# Altium schematic sheet power.SchDoc
size A2
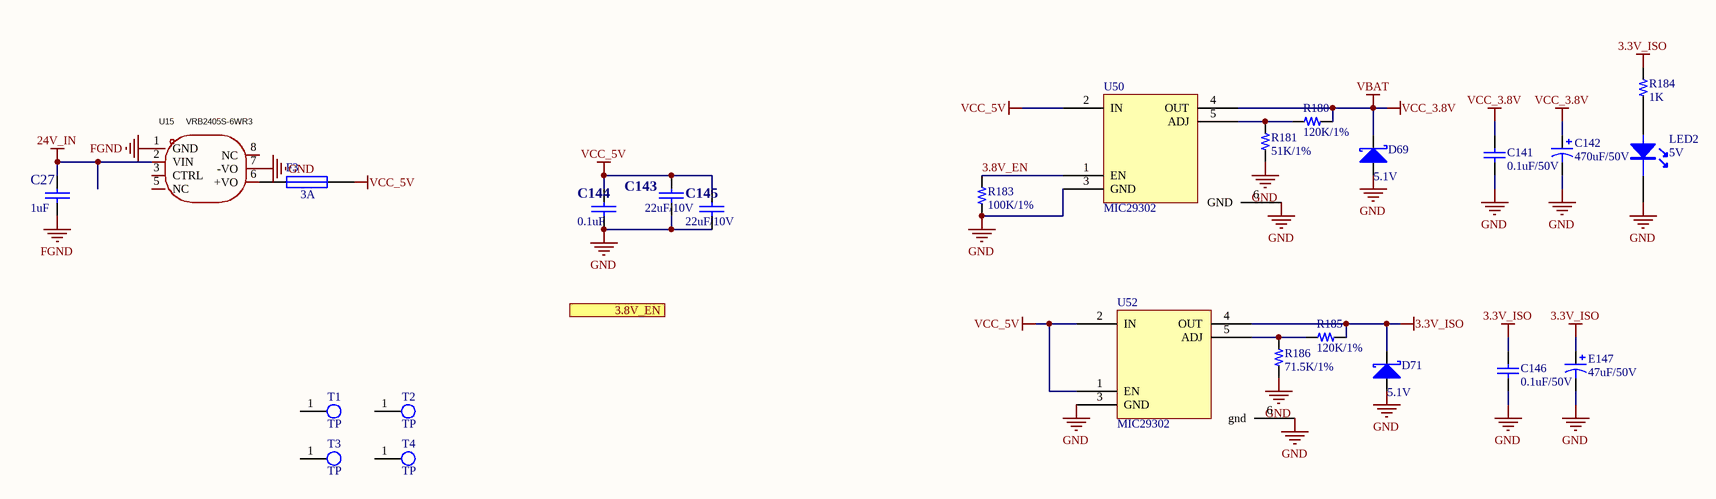
[diagram p0: power.SchDoc]

## Parts
C27  1uF  [0603C]
C141  0.1uF/50V  [0603C]
C142  470uF/50V  [Φ10×10]
C143  22uF/10V  [1210C]
C144  0.1uF  [0603C]
C145  22uF/10V  [1210C]
C146  0.1uF/50V  [0603C]
D69  5.1V  [SMA]
D71  5.1V  [SMA]
E147  47uF/50V  [Φ10×10]
F3  3A  [1812-F]
LED2  5V  [0603LED]
R180  120K/1%  [0603R]
R181  51K/1%  [0603R]
R183  100K/1%  [0603R]
R184  1K  [0603R]
R185  120K/1%  [0603R]
R186  71.5K/1%  [0603R]
T1  TP  [M3]
T2  TP  [M3]
T3  TP  [M3]
T4  TP  [M3]
U15  VRB2405S-6WR3  [PWRM-TH_VRB2405S-6WR3]
U50  MIC29302  [TO228P1435X457-6N]
U52  MIC29302  [TO228P1435X457-6N]

## Ports
3.8V_EN (in)

## Nets
3.3V_ISO: C146.2 D71.2(K) E147.1 R184.2 R185.1 U52.4(OUT)
24V_IN: C27.2 U15.2(VIN)
FGND: C27.1 U15.1(GND)
GND: C141.1 C142.2 C143.2 C144.2 C145.2 C146.1 D69.1(A) D71.1(A) E147.2 LED2.2 R181.1 R183.1 R186.1 U15.7(-VO) U50.3(GND) U50.6(GND) U52.3(GND) U52.6(gnd)
VBAT: C141.2 C142.1 D69.2(K) R180.1 U50.4(OUT)  [also labelled VCC_3.8V]
VCC_5V: C143.1 C144.1 C145.1 F3.2 U50.2(IN) U52.1(EN) U52.2(IN)
3.8V_EN: R183.2 U50.1(EN)
NetF3_1: F3.1 U15.6(+VO)
NetLED2_1: LED2.1 R184.1
NetR180_2: R180.2 R181.2 U50.5(ADJ)
NetR185_2: R185.2 R186.2 U52.5(ADJ)

Not connected (* = marked no-connect by the designer): T1 1; T2 1; T3 1; T4 1; U15 3(CTRL) 5(NC) 8(NC)

## Library data of the parts
C27 C143-C145 = CAP: Capacitor
C141 C146 = Cap: Capacitor; Value: 22nF; Published: 8-Jun-2000; LatestRevisionDate: 17-Jul-2002; LatestRevisionNote: Re-released for DXP Platform.; PackageReference: RAD-0.3; Publisher: Altium Limited; PackageDescription: Radial Cap, Thru-Hole; 2 Leads; 0.3 in Pin Spacing
C142 E147 = Cap Pol1: Polarized Capacitor (Radial); Value: 100pF; Published: 8-Jun-2000; LatestRevisionDate: 17-Jul-2002; LatestRevisionNote: Re-released for DXP Platform.; PackageReference: RB7.6-15; Publisher: Altium Limited
D69 D71 = DIODE S: Schottky Diode
F3 = Fuse 1: Fuse; Published: 8-Jun-2000; LatestRevisionDate: 17-Jul-2002; LatestRevisionNote: Re-released for DXP Platform.; PackageReference: PIN-W2/E2.8; Publisher: Altium Limited; PackageDescription: Thru-Hole; 2 Leads
LED2 = LED
R180 R181 R183-R186 = R
U15 = VRB2405S-6WR3_1: Manufacturer: YLPTEC(易川); Symbol: VRB2405S-6WR3_C5369848; Add into BOM: yes; Number of channel: 1; Power: 6W; input voltage (Vdc): 18V~36V; Conversion Efficiency: 83%; Output Voltage: 5V; Output Current (Max): 1200mA; Maximum Capacitive Load: 1000uF; Insulated Voltage: 1600V; Protective function: 短路保护；低功耗; Device: VRB2405S-6WR3_1; LCSC Part Name: DC-DC 输入电压18V~36V 输出电压5V输出功率6W1200mA; Supplier Part: C5369848; Manufacturer Part: VRB2405S-6WR3; Supplier Footprint: SIP-8; JLCPCB Part Class: Extended Part; Datasheet: https://atta.szlcsc.com/upload/public/pdf/source/20230612/8A284C0EB4CAD53F2D8A542BA70C1C2A.pdf; Supplier: LCSC; Convert to PCB: yes; TYPE: 降压型